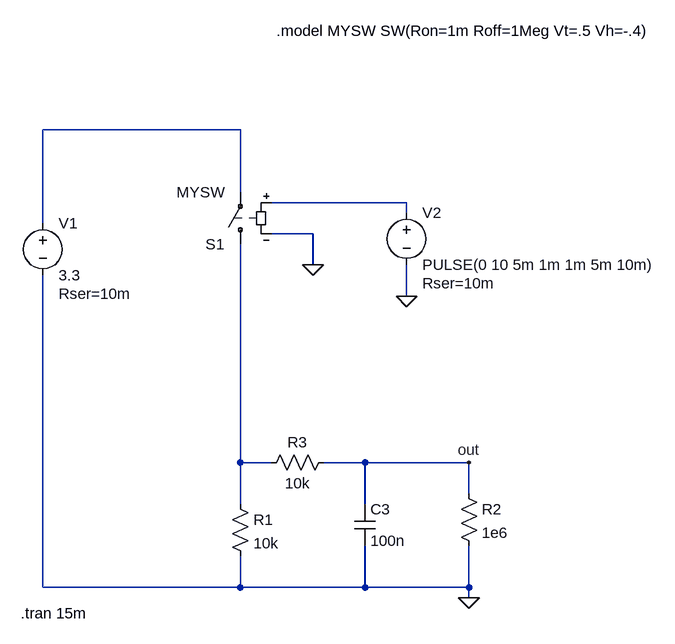
[diagram p0: schematic switch_debouncing.asc]
switch_debouncing.asc, the LTspice schematic file:
Version 4
SHEET 1 1008 872
WIRE 368 112 64 112
WIRE 368 208 368 112
WIRE 624 224 416 224
WIRE 624 240 624 224
WIRE 64 256 64 112
WIRE 480 272 416 272
WIRE 480 320 480 272
WIRE 624 368 624 320
WIRE 368 624 368 288
WIRE 416 624 368 624
WIRE 560 624 496 624
WIRE 720 624 560 624
WIRE 720 672 720 624
WIRE 368 688 368 624
WIRE 560 688 560 624
WIRE 64 816 64 336
WIRE 368 816 368 768
WIRE 368 816 64 816
WIRE 560 816 560 752
WIRE 560 816 368 816
WIRE 720 816 720 752
WIRE 720 816 560 816
WIRE 720 832 720 816
FLAG 480 320 0
FLAG 720 832 0
FLAG 720 624 out
FLAG 624 368 0
SYMBOL voltage 64 240 R0
WINDOW 123 0 0 Left 0
WINDOW 39 24 124 Left 2
SYMATTR InstName V1
SYMATTR Value 3.3
SYMATTR SpiceLine Rser=10m
SYMBOL sw 368 304 R180
SYMATTR InstName S1
SYMATTR Value MYSW
SYMBOL voltage 624 224 R0
WINDOW 123 0 0 Left 0
WINDOW 39 24 124 Left 2
SYMATTR InstName V2
SYMATTR Value PULSE(0 10 5m 1m 1m 5m 10m)
SYMATTR SpiceLine Rser=10m
SYMBOL res 352 672 R0
SYMATTR InstName R1
SYMATTR Value 10k
SYMBOL res 704 656 R0
SYMATTR InstName R2
SYMATTR Value 1e6
SYMBOL cap 544 688 R0
SYMATTR InstName C3
SYMATTR Value 100n
SYMBOL res 512 608 R90
WINDOW 0 0 56 VBottom 2
WINDOW 3 32 56 VTop 2
SYMATTR InstName R3
SYMATTR Value 10k
TEXT 424 -40 Left 2 !.model MYSW SW(Ron=1m Roff=1Meg Vt=.5 Vh=-.4)
TEXT 30 856 Left 2 !.tran 15m

The netlist it stands for:
* switch_debouncing.asc
V1 N001 0 3.3 Rser=10m
S1 N003 N001 N002 0 MYSW
V2 N002 0 PULSE(0 10 5m 1m 1m 5m 10m) Rser=10m
R1 N003 0 10k
R2 out 0 1e6
C3 out 0 100n
R3 out N003 10k
.model MYSW SW(Ron=1m Roff=1Meg Vt=.5 Vh=-.4)
.tran 15m
.backanno
.end